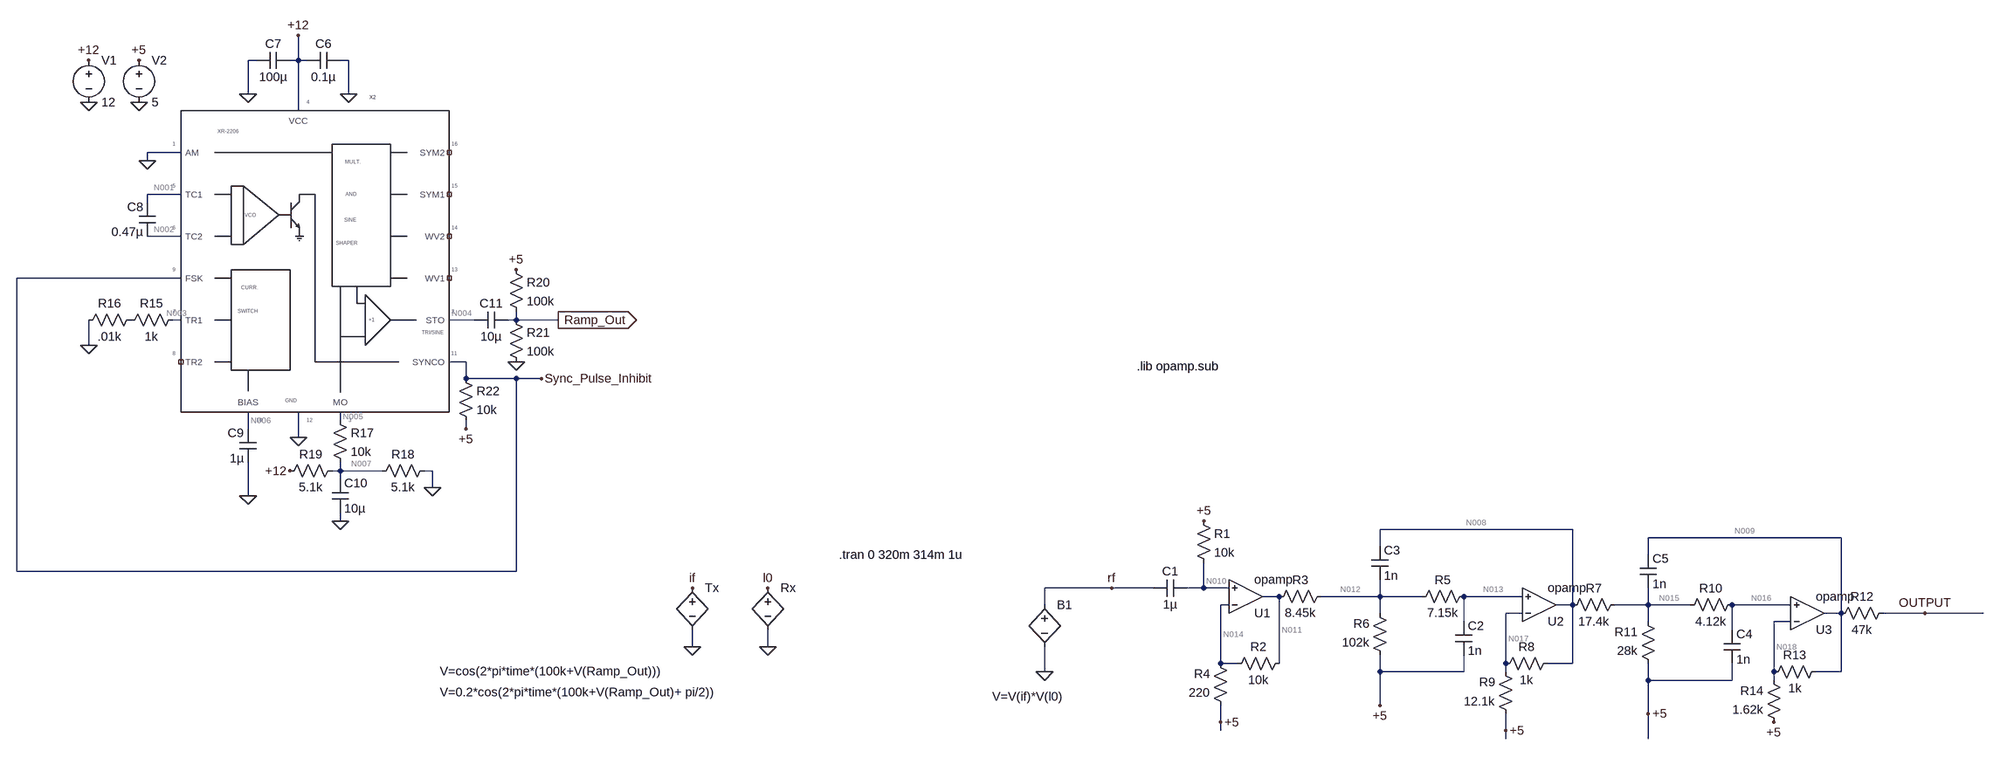
[diagram p0: schematic Integration.asc]
Integration.asc, the LTspice schematic file:
Version 4
SHEET 1 880 680
WIRE -3072 -1328 -3088 -1328
WIRE -2992 -1328 -2992 -1376
WIRE -2992 -1328 -3008 -1328
WIRE -2976 -1328 -2992 -1328
WIRE -2896 -1328 -2912 -1328
WIRE -3088 -1264 -3088 -1328
WIRE -2896 -1264 -2896 -1328
WIRE -2992 -1232 -2992 -1328
WIRE -3216 -1152 -3280 -1152
WIRE -3280 -1136 -3280 -1152
WIRE -3216 -1072 -3280 -1072
WIRE -3280 -1056 -3280 -1072
WIRE -3216 -992 -3280 -992
WIRE -3216 -912 -3536 -912
WIRE -3216 -832 -3232 -832
WIRE -2656 -832 -2704 -832
WIRE -2576 -832 -2576 -848
WIRE -2576 -832 -2592 -832
WIRE -2496 -832 -2576 -832
WIRE -3392 -784 -3392 -832
WIRE -2672 -752 -2704 -752
WIRE -2672 -720 -2672 -752
WIRE -2576 -720 -2672 -720
WIRE -2528 -720 -2576 -720
WIRE -2912 -640 -2912 -656
WIRE -3088 -624 -3088 -656
WIRE -2672 -624 -2672 -640
WIRE -2992 -608 -2992 -656
WIRE -2912 -544 -2912 -560
WIRE -2912 -544 -2928 -544
WIRE -2832 -544 -2912 -544
WIRE -2736 -544 -2752 -544
WIRE -2912 -528 -2912 -544
WIRE -2736 -512 -2736 -544
WIRE -3088 -496 -3088 -560
WIRE -2912 -448 -2912 -464
WIRE -560 -432 -928 -432
WIRE -48 -416 -416 -416
WIRE -928 -400 -928 -432
WIRE -416 -384 -416 -416
WIRE -3536 -352 -3536 -912
WIRE -2576 -352 -2576 -720
WIRE -2576 -352 -3536 -352
WIRE -1440 -320 -1568 -320
WIRE -1360 -320 -1440 -320
WIRE -1264 -320 -1264 -368
WIRE -1264 -320 -1296 -320
WIRE -1216 -320 -1264 -320
WIRE -1120 -304 -1152 -304
WIRE -928 -304 -928 -336
WIRE -928 -304 -1040 -304
WIRE -848 -304 -928 -304
WIRE -656 -304 -768 -304
WIRE -1568 -288 -1568 -320
WIRE -1216 -288 -1232 -288
WIRE -560 -288 -560 -432
WIRE -560 -288 -592 -288
WIRE -416 -288 -416 -320
WIRE -416 -288 -480 -288
WIRE -336 -288 -416 -288
WIRE -144 -288 -256 -288
WIRE -928 -272 -928 -304
WIRE -656 -272 -688 -272
WIRE -48 -272 -48 -416
WIRE -48 -272 -80 -272
WIRE 112 -272 32 -272
WIRE 224 -272 112 -272
WIRE -768 -256 -768 -304
WIRE -416 -256 -416 -288
WIRE -144 -256 -176 -256
WIRE -256 -240 -256 -288
WIRE -2240 -208 -2240 -240
WIRE -2096 -208 -2096 -240
WIRE -1232 -176 -1232 -288
WIRE -1200 -176 -1232 -176
WIRE -1120 -176 -1120 -304
WIRE -688 -176 -688 -272
WIRE -560 -176 -560 -288
WIRE -560 -176 -608 -176
WIRE -1568 -160 -1568 -208
WIRE -928 -160 -928 -192
WIRE -768 -160 -768 -192
WIRE -768 -160 -928 -160
WIRE -688 -160 -688 -176
WIRE -176 -160 -176 -256
WIRE -48 -160 -48 -272
WIRE -48 -160 -96 -160
WIRE -416 -144 -416 -176
WIRE -256 -144 -256 -176
WIRE -256 -144 -416 -144
WIRE -176 -144 -176 -160
WIRE -928 -96 -928 -160
WIRE -416 -80 -416 -144
WIRE -1232 -64 -1232 -96
WIRE -1232 -48 -1232 -64
WIRE -688 -48 -688 -80
WIRE -688 -32 -688 -48
WIRE -416 -32 -416 -80
FLAG 112 -272 OUTPUT
FLAG -176 -64 +5
FLAG -416 -80 +5
FLAG -688 -48 +5
FLAG -928 -96 +5
FLAG -1264 -448 +5
FLAG -1232 -64 +5
FLAG -2240 -208 0
FLAG -2096 -208 0
FLAG -2240 -320 if
FLAG -2096 -320 l0
FLAG -1568 -160 0
FLAG -1440 -320 rf
FLAG -3296 -1248 0
FLAG -3392 -1248 0
FLAG -3392 -1328 +12
FLAG -3296 -1328 +5
FLAG -2496 -832 Ramp_Out
IOPIN -2496 -832 Out
FLAG -2992 -1376 +12
FLAG -3088 -1264 0
FLAG -2896 -1264 0
FLAG -3280 -1136 0
FLAG -3392 -784 0
FLAG -3088 -496 0
FLAG -2992 -608 0
FLAG -2912 -448 0
FLAG -3008 -544 +12
FLAG -2736 -512 0
FLAG -2672 -624 +5
FLAG -2528 -720 Sync_Pulse_Inhibit
FLAG -2576 -928 +5
FLAG -2576 -752 0
SYMBOL Opamps\\opamp -1184 -240 M180
SYMATTR InstName U1
SYMBOL Opamps\\opamp -624 -224 M180
SYMATTR InstName U2
SYMBOL res -1280 -464 R0
SYMATTR InstName R1
SYMATTR Value 10k
SYMBOL res -1216 -160 R270
WINDOW 0 32 56 VTop 2
WINDOW 3 0 56 VBottom 2
SYMATTR InstName R2
SYMATTR Value 10k
SYMBOL res -1136 -288 R270
WINDOW 0 32 56 VTop 2
WINDOW 3 0 56 VBottom 2
SYMATTR InstName R3
SYMATTR Value 8.45k
SYMBOL res -1216 -80 R180
WINDOW 0 36 76 Left 2
WINDOW 3 36 40 Left 2
SYMATTR InstName R4
SYMATTR Value 220
SYMBOL cap -1296 -336 R90
WINDOW 0 0 32 VBottom 2
WINDOW 3 32 32 VTop 2
SYMATTR InstName C1
SYMATTR Value 1µ
SYMBOL res -752 -320 R90
WINDOW 0 0 56 VBottom 2
WINDOW 3 32 56 VTop 2
SYMATTR InstName R5
SYMATTR Value 7.15k
SYMBOL res -912 -176 R180
WINDOW 0 36 76 Left 2
WINDOW 3 36 40 Left 2
SYMATTR InstName R6
SYMATTR Value 102k
SYMBOL cap -784 -256 R0
SYMATTR InstName C2
SYMATTR Value 1n
SYMBOL cap -944 -400 R0
SYMATTR InstName C3
SYMATTR Value 1n
SYMBOL res -576 -272 R270
WINDOW 0 32 56 VTop 2
WINDOW 3 0 56 VBottom 2
SYMATTR InstName R7
SYMATTR Value 17.4k
SYMBOL res -704 -160 R270
WINDOW 0 32 56 VTop 2
WINDOW 3 0 56 VBottom 2
SYMATTR InstName R8
SYMATTR Value 1k
SYMBOL res -672 -64 R180
WINDOW 0 36 76 Left 2
WINDOW 3 36 40 Left 2
SYMATTR InstName R9
SYMATTR Value 12.1k
SYMBOL Opamps\\opamp -112 -208 M180
SYMATTR InstName U3
SYMBOL res -240 -304 R90
WINDOW 0 0 56 VBottom 2
WINDOW 3 32 56 VTop 2
SYMATTR InstName R10
SYMATTR Value 4.12k
SYMBOL res -400 -160 R180
WINDOW 0 36 76 Left 2
WINDOW 3 36 40 Left 2
SYMATTR InstName R11
SYMATTR Value 28k
SYMBOL cap -272 -240 R0
SYMATTR InstName C4
SYMATTR Value 1n
SYMBOL cap -432 -384 R0
SYMATTR InstName C5
SYMATTR Value 1n
SYMBOL res -64 -256 R270
WINDOW 0 32 56 VTop 2
WINDOW 3 0 56 VBottom 2
SYMATTR InstName R12
SYMATTR Value 47k
SYMBOL res -192 -144 R270
WINDOW 0 32 56 VTop 2
WINDOW 3 0 56 VBottom 2
SYMATTR InstName R13
SYMATTR Value 1k
SYMBOL res -160 -48 R180
WINDOW 0 36 76 Left 2
WINDOW 3 36 40 Left 2
SYMATTR InstName R14
SYMATTR Value 1.62k
SYMBOL bv -1568 -304 R0
WINDOW 3 -100 191 Left 2
SYMATTR Value V=V(if)*V(l0)
SYMATTR InstName B1
SYMBOL bv -2096 -336 R0
WINDOW 3 -626 215 Left 2
SYMATTR Value V=0.2*cos(2*pi*time*(100k+V(Ramp_Out)+ pi/2))
SYMATTR InstName Rx
SYMBOL bv -2240 -336 R0
WINDOW 3 -482 175 Left 2
SYMATTR Value V=cos(2*pi*time*(100k+V(Ramp_Out)))
SYMATTR InstName Tx
SYMBOL voltage -3392 -1344 R0
WINDOW 123 0 0 Left 2
WINDOW 39 0 0 Left 2
SYMATTR InstName V1
SYMATTR Value 12
SYMBOL voltage -3296 -1344 R0
WINDOW 123 0 0 Left 2
WINDOW 39 0 0 Left 2
SYMATTR InstName V2
SYMATTR Value 5
SYMBOL XR2206 -3120 -1072 R0
SYMATTR InstName X2
SYMBOL cap -2912 -1344 R90
WINDOW 0 0 32 VBottom 2
WINDOW 3 32 32 VTop 2
SYMATTR InstName C6
SYMATTR Value 0.1µ
SYMBOL cap -3008 -1344 R90
WINDOW 0 0 32 VBottom 2
WINDOW 3 32 32 VTop 2
SYMATTR InstName C7
SYMATTR Value 100µ
SYMBOL cap -3264 -992 R180
WINDOW 0 24 56 Left 2
WINDOW 3 24 8 Left 2
SYMATTR InstName C8
SYMATTR Value 0.47µ
SYMBOL res -3216 -848 R90
WINDOW 0 0 56 VBottom 2
WINDOW 3 32 56 VTop 2
SYMATTR InstName R15
SYMATTR Value 1k
SYMBOL res -3296 -848 R90
WINDOW 0 0 56 VBottom 2
WINDOW 3 32 56 VTop 2
SYMATTR InstName R16
SYMATTR Value .01k
SYMBOL cap -3072 -560 R180
WINDOW 0 24 56 Left 2
WINDOW 3 24 8 Left 2
SYMATTR InstName C9
SYMATTR Value 1µ
SYMBOL res -2928 -656 R0
SYMATTR InstName R17
SYMATTR Value 10k
SYMBOL res -2736 -560 R90
WINDOW 0 0 56 VBottom 2
WINDOW 3 32 56 VTop 2
SYMATTR InstName R18
SYMATTR Value 5.1k
SYMBOL res -2912 -560 R90
WINDOW 0 0 56 VBottom 2
WINDOW 3 32 56 VTop 2
SYMATTR InstName R19
SYMATTR Value 5.1k
SYMBOL cap -2928 -528 R0
SYMATTR InstName C10
SYMATTR Value 10µ
SYMBOL cap -2592 -848 R90
WINDOW 0 0 32 VBottom 2
WINDOW 3 32 32 VTop 2
SYMATTR InstName C11
SYMATTR Value 10µ
SYMBOL res -2592 -944 R0
SYMATTR InstName R20
SYMATTR Value 100k
SYMBOL res -2592 -848 R0
SYMATTR InstName R21
SYMATTR Value 100k
SYMBOL res -2688 -736 R0
SYMATTR InstName R22
SYMATTR Value 10k
TEXT -1392 -744 Left 2 !.lib opamp.sub
TEXT -1960 -384 Left 2 !.tran 0 320m 314m 1u

The netlist it stands for:
* Integration.asc
XU1 N014 N010 N011 opamp Aol=100K GBW=10Meg  ; pins invin noninvin out
XU2 N017 N013 N008 opamp Aol=100K GBW=10Meg  ; pins invin noninvin out
R1 +5 N010 10k
R2 N014 N011 10k
R3 N011 N012 8.45k
R4 +5 N014 220
C1 N010 rf 1µ
R5 N013 N012 7.15k
R6 +5 N012 102k
C2 N013 +5 1n
C3 N008 N012 1n
R7 N008 N015 17.4k
R8 N017 N008 1k
R9 +5 N017 12.1k
XU3 N018 N016 N009 opamp Aol=100K GBW=10Meg  ; pins invin noninvin out
R10 N016 N015 4.12k
R11 +5 N015 28k
C4 N016 +5 1n
C5 N009 N015 1n
R12 N009 OUTPUT 47k
R13 N018 N009 1k
R14 +5 N018 1.62k
B1 rf 0 V=V(if)*V(l0)
B§Rx l0 0 V=0.2*cos(2*pi*time*(100k+V(Ramp_Out)+ pi/2))
B§Tx if 0 V=cos(2*pi*time*(100k+V(Ramp_Out)))
V1 +12 0 12
V2 +5 0 5
XX2 0 N004 N005 +12 N001 N002 N003 NC_01 Sync_Pulse_Inhibit N006 Sync_Pulse_Inhibit 0 NC_02 NC_03 NC_04 NC_05 XR2206  ; pins AM STO MO VCC TC1 TC2 TR1 TR2 FSK BIAS SYNCO COM WV1 WV2 SYM1 SYM2
C6 0 +12 0.1µ
C7 +12 0 100µ
C8 N002 N001 0.47µ
R15 N003 P001 1k
R16 P001 0 .01k
C9 0 N006 1µ
R17 N005 N007 10k
R18 0 N007 5.1k
R19 N007 +12 5.1k
C10 N007 0 10µ
C11 Ramp_Out N004 10µ
R20 +5 Ramp_Out 100k
R21 Ramp_Out 0 100k
R22 Sync_Pulse_Inhibit +5 10k
.lib opamp.sub
.tran 0 320m 314m 1u
.lib XR2206.sub
.backanno
.end

* Results of the author's LTspice run, read from the files saved beside the schematic
* Operating Point, zero values left out:
*   V(n011) = 4.998 V
*   V(n010) = 5 V
*   V(n014) = 5 V
*   V(n008) = 4.998 V
*   V(n013) = 4.998 V
*   V(n017) = 4.998 V
*   V(+5) = 5 V
*   V(n012) = 4.998 V
*   V(rf) = 200 mV
*   V(n015) = 4.999 V
*   V(n009) = 4.998 V
*   V(n016) = 4.999 V
*   V(n018) = 4.998 V
*   V(output) = 4.998 V
*   V(l0) = 200 mV
*   V(if) = 1 V
*   V(+12) = 12 V
*   V(n002) = 4.533 V
*   V(n003) = 3.956 V
*   V(n001) = 4.533 V
*   V(n006) = 3.04 V
*   V(sync_pulse_inhibit) = 732.5 mV
*   V(n005) = 5.964 V
*   V(n004) = 5.932 V
*   V(p001) = 39.17 mV
*   V(n007) = 5.993 V
*   V(ramp_out) = 2.5 V
*   I(R22) = -426.8 µA
*   I(R21) = 25 µA
*   I(R20) = 25 µA
*   I(R19) = -1.178 mA
*   I(R18) = -1.175 mA
*   I(R17) = -2.902 µA
*   I(R16) = 3.917 mA
*   I(R15) = 3.917 mA
*   I(R14) = 935.1 nA
*   I(R13) = 935.1 nA
*   I(R11) = 52.32 nA
*   I(R9) = 181.3 nA
*   I(R8) = 181.3 nA
*   I(R7) = -52.32 nA
*   I(R6) = 21.02 nA
*   I(R4) = 227.2 nA
*   I(R3) = -21.02 nA
*   I(R2) = 227.2 nA
*   I(V2) = -453.2 µA
*   I(V1) = -20.96 mA